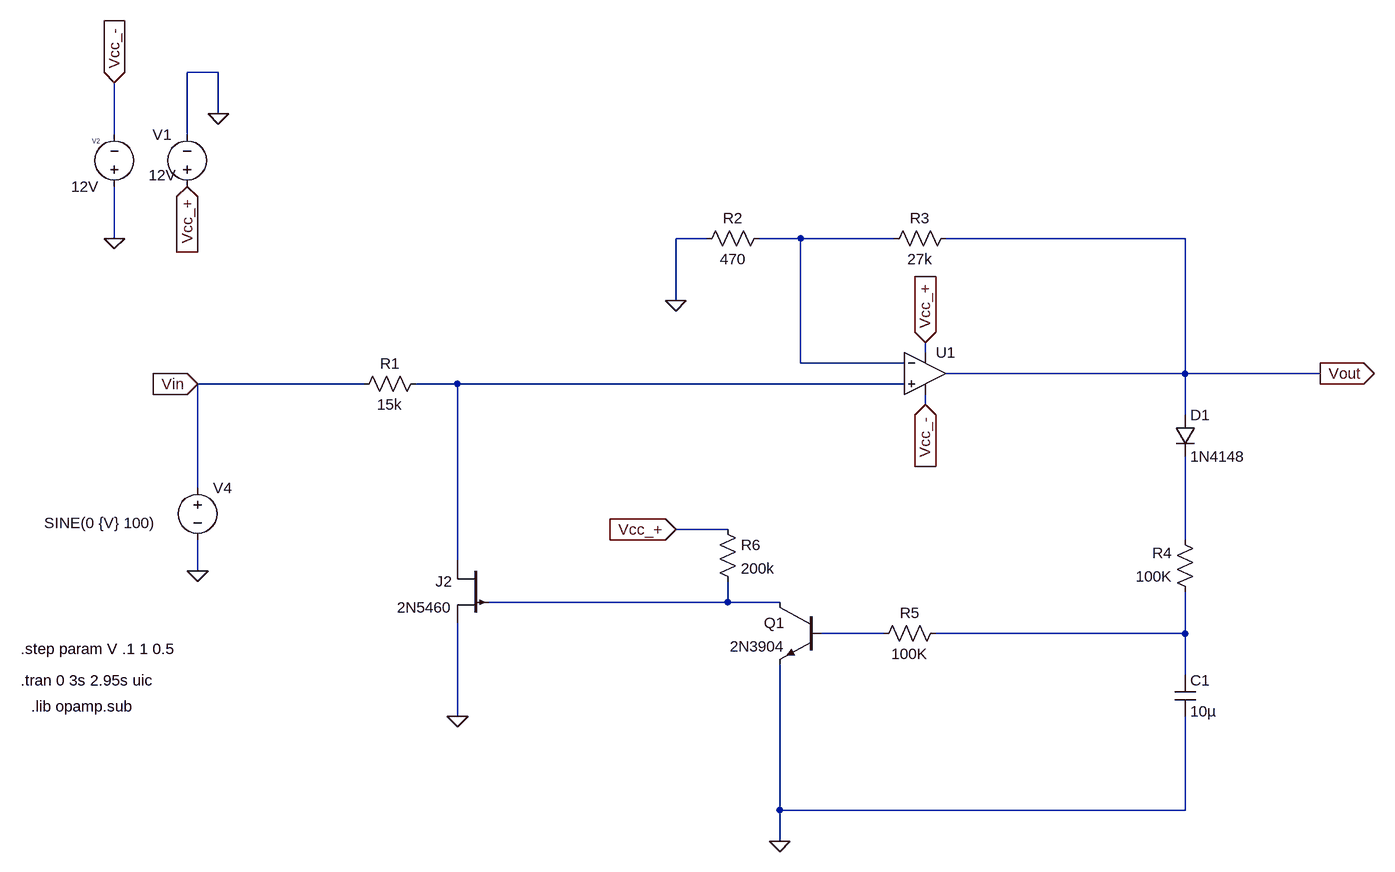
[diagram p0: schematic agc_JFET.asc]
agc_JFET.asc, the LTspice schematic file:
Version 4
SHEET 1 1680 820
WIRE -304 -400 -352 -400
WIRE -304 -336 -304 -400
WIRE -464 -304 -464 -384
WIRE -352 -304 -352 -400
WIRE -464 -144 -464 -224
WIRE 448 -144 400 -144
WIRE 592 -144 528 -144
WIRE 736 -144 592 -144
WIRE 1184 -144 816 -144
WIRE 400 -48 400 -144
WIRE 784 32 784 16
WIRE 592 48 592 -144
WIRE 752 48 592 48
WIRE 1184 64 1184 -144
WIRE 1184 64 816 64
WIRE 1392 64 1184 64
WIRE -80 80 -336 80
WIRE 64 80 0 80
WIRE 752 80 64 80
WIRE 784 112 784 96
WIRE 1184 128 1184 64
WIRE -336 240 -336 80
WIRE 480 304 400 304
WIRE 1184 320 1184 192
WIRE 64 352 64 80
WIRE -336 368 -336 320
WIRE 480 416 480 384
WIRE 480 416 112 416
WIRE 560 416 480 416
WIRE 720 464 624 464
WIRE 1184 464 1184 400
WIRE 1184 464 800 464
WIRE 1184 528 1184 464
WIRE 64 592 64 448
WIRE 560 736 560 512
WIRE 1184 736 1184 592
WIRE 1184 736 560 736
WIRE 560 784 560 736
FLAG 400 -48 0
FLAG -304 -336 0
FLAG -464 -144 0
FLAG 560 784 0
FLAG 64 592 0
FLAG -336 368 0
FLAG 1392 64 Vout
IOPIN 1392 64 Out
FLAG -336 80 Vin
IOPIN -336 80 In
FLAG 784 112 Vcc_-
IOPIN 784 112 In
FLAG -464 -384 Vcc_-
IOPIN -464 -384 In
FLAG 784 16 Vcc_+
IOPIN 784 16 In
FLAG -352 -224 Vcc_+
IOPIN -352 -224 In
FLAG 400 304 Vcc_+
IOPIN 400 304 In
SYMBOL Opamps\\UniversalOpamp2 784 64 R0
SYMATTR InstName U1
SYMBOL res 16 64 R90
WINDOW 0 0 56 VBottom 2
WINDOW 3 32 56 VTop 2
SYMATTR InstName R1
SYMATTR Value 15k
SYMBOL res 832 -160 R90
WINDOW 0 0 56 VBottom 2
WINDOW 3 32 56 VTop 2
SYMATTR InstName R3
SYMATTR Value 27k
SYMBOL res 1200 416 R180
WINDOW 0 36 76 Left 2
WINDOW 3 36 40 Left 2
SYMATTR InstName R4
SYMATTR Value 100K
SYMBOL res 704 480 R270
WINDOW 0 32 56 VTop 2
WINDOW 3 0 56 VBottom 2
SYMATTR InstName R5
SYMATTR Value 100K
SYMBOL npn 624 416 M0
SYMATTR InstName Q1
SYMATTR Value 2N3904
SYMBOL res 544 -160 R90
WINDOW 0 0 56 VBottom 2
WINDOW 3 32 56 VTop 2
SYMATTR InstName R2
SYMATTR Value 470
SYMBOL voltage -352 -208 R180
WINDOW 0 24 96 Left 2
WINDOW 3 38 49 Bottom 2
WINDOW 123 0 0 Left 0
WINDOW 39 0 0 Left 0
SYMATTR InstName V1
SYMATTR Value 12V
SYMBOL voltage -464 -208 R180
WINDOW 0 28 79 Top 0
WINDOW 3 24 16 Left 2
WINDOW 123 0 0 Left 0
WINDOW 39 0 0 Left 0
SYMATTR InstName V2
SYMATTR Value 12V
SYMBOL diode 1168 128 R0
SYMATTR InstName D1
SYMATTR Value 1N4148
SYMBOL cap 1168 528 R0
SYMATTR InstName C1
SYMATTR Value 10µ
SYMBOL pjf 112 352 M0
SYMATTR InstName J2
SYMATTR Value 2N5460
SYMBOL res 464 288 R0
SYMATTR InstName R6
SYMATTR Value 200k
SYMBOL voltage -336 224 R0
WINDOW 3 -236 70 Left 2
WINDOW 123 0 0 Left 0
WINDOW 39 0 0 Left 0
SYMATTR Value SINE(0 {V} 100)
SYMATTR InstName V4
TEXT -608 488 Left 2 !.step param V .1 1 0.5
TEXT -608 536 Left 2 !.tran 0 3s 2.95s uic
TEXT -592 576 Left 2 !.lib opamp.sub

The netlist it stands for:
* agc_JFET.asc
XU1 N002 N001 Vcc_+ Vcc_- Vout level.2 Avol=1Meg GBW=10Meg Slew=10Meg ilimit=25m rail=0 Vos=0 phimargin=45 en=0 enk=0 in=0 ink=0 Rin=500Meg  ; pins IN+ IN- V+ V- OUT
R1 N002 Vin 15k
R3 Vout N001 27k
R4 N006 N003 100K
R5 N005 N006 100K
Q1 N004 N005 0 0 2N3904
R2 N001 0 470
V1 Vcc_+ 0 12V
V2 0 Vcc_- 12V
D1 Vout N003 1N4148
C1 N006 0 10µ
J2 N002 N004 0 2N5460
R6 Vcc_+ N004 200k
V4 Vin 0 SINE(0 {V} 100)
.model D D
.lib standard.dio
.model NPN NPN
.model PNP PNP
.lib standard.bjt
.model NJF NJF
.model PJF PJF
.lib standard.jft
.step param V .1 1 0.5
.tran 0 3s 2.95s uic
.lib opamp.sub
.lib UniversalOpamps2.sub
.backanno
.end